# Altium schematic sheet fo_tx_array.SchDoc
size A3
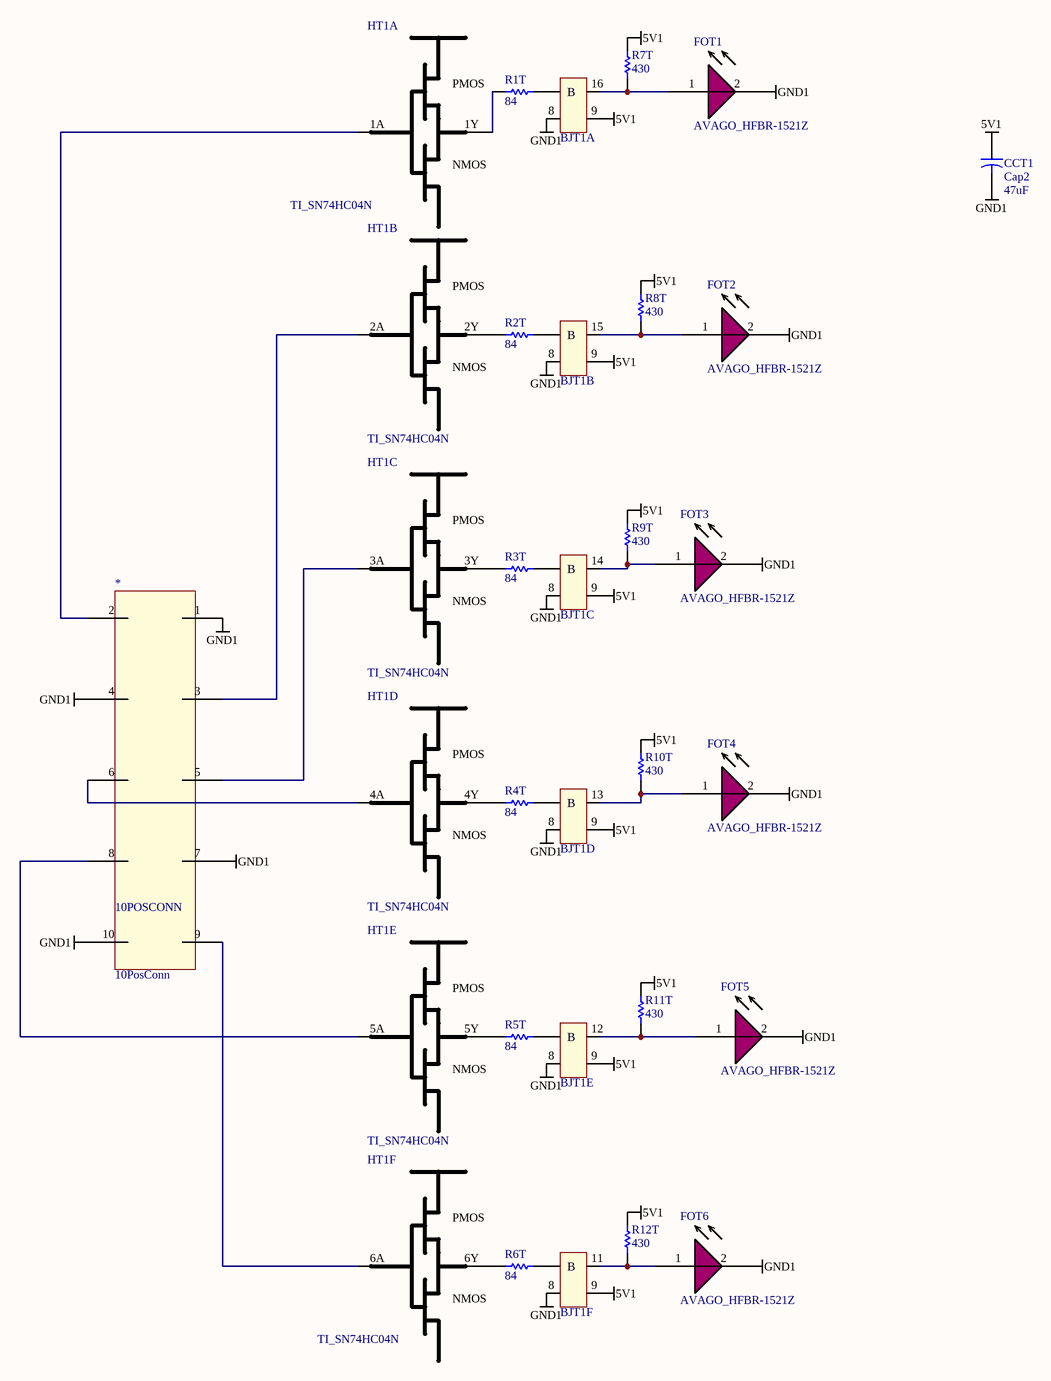
[diagram p0: fo_tx_array.SchDoc]

## Parts
*  10PosConn  [Conn_10Pos]
BJT1  ULN2003AN  [ULN2003AN]  (value not drawn)  (parts A,B,C,D,E,F of 7)
CCT1  Cap2  value 47uF  [CAPR5-4X5]
FOT1  AVAGO_HFBR-1521Z  [AVAGO_HFBR-1521Z]
FOT2  AVAGO_HFBR-1521Z  [AVAGO_HFBR-1521Z]
FOT3  AVAGO_HFBR-1521Z  [AVAGO_HFBR-1521Z]
FOT4  AVAGO_HFBR-1521Z  [AVAGO_HFBR-1521Z]
FOT5  AVAGO_HFBR-1521Z  [AVAGO_HFBR-1521Z]
FOT6  AVAGO_HFBR-1521Z  [AVAGO_HFBR-1521Z]
HT1  TI_SN74HC04N  [SN74HC04N]  (parts A,B,C,D,E,F of 7)
R1T  value 84  [AXIAL-0.3]
R2T  value 84  [AXIAL-0.3]
R3T  value 84  [AXIAL-0.3]
R4T  value 84  [AXIAL-0.3]
R5T  value 84  [AXIAL-0.3]
R6T  value 84  [AXIAL-0.3]
R7T  value 430  [AXIAL-0.3]  (hidden comment: Res1)
R8T  value 430  [AXIAL-0.3]  (hidden comment: Res1)
R9T  value 430  [AXIAL-0.3]  (hidden comment: Res1)
R10T  value 430  [AXIAL-0.3]  (hidden comment: Res1)
R11T  value 430  [AXIAL-0.3]  (hidden comment: Res1)
R12T  value 430  [AXIAL-0.3]  (hidden comment: Res1)

## Nets
5V1: BJT1.9(COM) CCT1.1 HT1.5V R7T.1 R8T.1 R9T.1 R10T.1 R11T.1 R12T.1
GND1: *.1 *.4 *.7 *.10 BJT1.8(E) CCT1.2 FOT1.2 FOT2.2 FOT3.2 FOT4.2 FOT5.2 FOT6.2 HT1.GND
Net*_2: *.2 HT1.1A
Net*_3: *.3 HT1.2A
Net*_5: *.5 HT1.3A
Net*_6: *.6 HT1.4A
Net*_8: *.8 HT1.5A
Net*_9: *.9 HT1.6A
NetBJT1_1: BJT1.1(B) R1T.2
NetBJT1_2: BJT1.2(B) R2T.2
NetBJT1_3: BJT1.3(B) R3T.2
NetBJT1_4: BJT1.4(B) R4T.2
NetBJT1_5: BJT1.5(B) R5T.2
NetBJT1_6: BJT1.6(B) R6T.2
NetBJT1_11: BJT1.11(C) FOT6.1 R12T.2
NetBJT1_12: BJT1.12(C) FOT5.1 R11T.2
NetBJT1_13: BJT1.13(C) FOT4.1 R10T.2
NetBJT1_14: BJT1.14(C) FOT3.1 R9T.2
NetBJT1_15: BJT1.15(C) FOT2.1 R8T.2
NetBJT1_16: BJT1.16(C) FOT1.1 R7T.2
NetHT1_1Y: HT1.1Y R1T.1
NetHT1_2Y: HT1.2Y R2T.1
NetHT1_3Y: HT1.3Y R3T.1
NetHT1_4Y: HT1.4Y R4T.1
NetHT1_5Y: HT1.5Y R5T.1
NetHT1_6Y: HT1.6Y R6T.1

## Notes on the sheet
- (in symbol 10PosConn) 10POSCONN
- (in symbol TI_SN74HC04N, part A) PMOS; NMOS
- (in symbol TI_SN74HC04N, part B) PMOS; NMOS
- (in symbol TI_SN74HC04N, part C) PMOS; NMOS
- (in symbol TI_SN74HC04N, part D) PMOS; NMOS
- (in symbol TI_SN74HC04N, part E) PMOS; NMOS
- (in symbol TI_SN74HC04N, part F) PMOS; NMOS

## Library data of the parts
CCT1 = Cap2: Capacitor; Published: 23-Sep-2002; PackageReference: CAPR5-4X5; Publisher: Altium Limited; PackageDescription: Capacitor; 2 Leads
FOT1-FOT6 = AVAGO_HFBR-1521Z: Optical Fiber Transmitter
HT1 = TI_SN74HC04N: Hex Inverter 5V
R1T R2T R3T R4T R5T R6T R7T R8T R9T R10T R11T R12T = Res1: Resistor; Published: 8-Jun-2000; LatestRevisionDate: 17-Jul-2002; LatestRevisionNote: Re-released for DXP Platform.; PackageReference: AXIAL-0.3; Publisher: Altium Limited; PackageDescription: Axial Device, Thru-Hole; 2 Leads; 0.3 in Pin Spacing